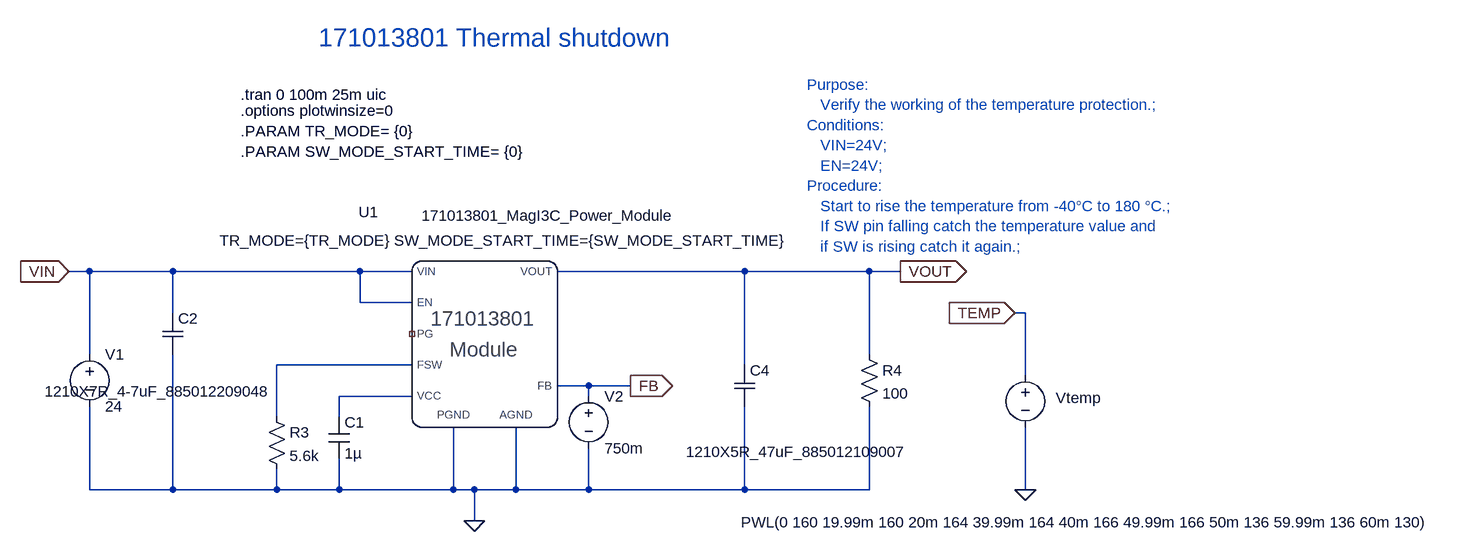
[diagram p0: schematic 171013801 thermal shutdown.asc]
171013801 thermal shutdown.asc, the LTspice schematic file:
Version 4
SHEET 1 1696 872
WIRE -384 48 -416 48
WIRE -256 48 -384 48
WIRE 32 48 -256 48
WIRE 112 48 32 48
WIRE 624 48 336 48
WIRE 816 48 624 48
WIRE 864 48 816 48
WIRE 32 96 32 48
WIRE 112 96 32 96
WIRE -256 112 -256 48
WIRE 1056 112 1040 112
WIRE -384 176 -384 48
WIRE 816 176 816 48
WIRE 112 192 -96 192
WIRE 624 192 624 48
WIRE 1056 208 1056 112
WIRE 384 224 336 224
WIRE 448 224 384 224
WIRE 112 240 0 240
WIRE 384 240 384 224
WIRE -96 272 -96 192
WIRE 0 272 0 240
WIRE -384 384 -384 256
WIRE -256 384 -256 176
WIRE -256 384 -384 384
WIRE -96 384 -96 352
WIRE -96 384 -256 384
WIRE 0 384 0 336
WIRE 0 384 -96 384
WIRE 176 384 176 288
WIRE 176 384 0 384
WIRE 208 384 176 384
WIRE 272 384 272 288
WIRE 272 384 208 384
WIRE 384 384 384 320
WIRE 384 384 272 384
WIRE 624 384 624 256
WIRE 624 384 384 384
WIRE 816 384 816 256
WIRE 816 384 624 384
WIRE 1056 384 1056 288
WIRE 208 432 208 384
FLAG 208 432 0
FLAG -416 48 VIN
IOPIN -416 48 In
FLAG 1056 384 0
FLAG 1040 112 TEMP
IOPIN 1040 112 In
FLAG 864 48 VOUT
IOPIN 864 48 Out
FLAG 448 224 FB
IOPIN 448 224 Out
SYMBOL res -112 256 R0
SYMATTR InstName R3
SYMATTR Value 5.6k
SYMBOL cap -16 272 R0
SYMATTR InstName C1
SYMATTR Value 1µ
SYMATTR SpiceLine Rser=7.13m Lser=257p
SYMBOL voltage -384 160 R0
WINDOW 123 0 0 Left 0
WINDOW 39 0 0 Left 0
SYMATTR InstName V1
SYMATTR Value 24
SYMBOL voltage 1056 192 R0
WINDOW 123 0 0 Left 0
WINDOW 39 24 124 Left 2
WINDOW 0 117 51 Right 2
WINDOW 3 636 242 Right 2
SYMATTR InstName Vtemp
SYMATTR Value PWL(0 160 19.99m 160 20m 164 39.99m 164 40m 166 49.99m 166 50m 136 59.99m 136 60m 130)
SYMBOL res 800 160 R0
SYMATTR InstName R4
SYMATTR Value 100
SYMBOL voltage 384 224 R0
WINDOW 123 0 0 Left 0
WINDOW 39 0 0 Left 0
SYMATTR InstName V2
SYMATTR Value 750m
SYMBOL WCAP-CSGP_50V_DCbias -272 112 R0
WINDOW 38 -181 121 Left 2
SYMATTR SpiceModel 1210X7R_4-7uF_885012209048
SYMATTR InstName C2
SYMBOL WCAP-CSGP_10V_DCbias 608 192 R0
WINDOW 38 -74 134 Left 2
SYMATTR SpiceModel 1210X5R_47uF_885012109007
SYMATTR InstName C4
SYMBOL 171013801_MagI3C_Power_Module 256 64 R0
SYMATTR InstName U1
TEXT -32 -312 Left 4 ;171013801 Thermal shutdown
TEXT 720 -240 Left 2 ;Purpose: \n   Verify the working of the temperature protection.; \nConditions: \n   VIN=24V; \n   EN=24V; \nProcedure: \n   Start to rise the temperature from -40°C to 180 °C.; \n   If SW pin falling catch the temperature value and \n   if SW is rising catch it again.;
TEXT -152 -224 Left 2 !.tran 0 100m 25m uic
TEXT -152 -200 Left 2 !.options plotwinsize=0
TEXT -152 -168 Left 2 !.PARAM TR_MODE= {0}\n.PARAM SW_MODE_START_TIME= {0}

The netlist it stands for:
* 171013801 thermal shutdown.asc
R3 N001 0 5.6k
C1 N002 0 1µ Rser=7.13m Lser=257p
V1 VIN 0 24
Vtemp TEMP 0 PWL(0 160 19.99m 160 20m 164 39.99m 164 40m 166 49.99m 166 50m 136 59.99m 136 60m 130)
R4 VOUT 0 100
V2 FB 0 750m
XC2 VIN 0 1210X7R_4-7uF_885012209048  ; pins A B
XC4 VOUT 0 1210X5R_47uF_885012109007  ; pins A B
XU1 VOUT FB VIN VIN NC_01 N001 N002 0 0 171013801_MagI3C_Power_Module TR_MODE={TR_MODE} SW_MODE_START_TIME={SW_MODE_START_TIME}  ; pins VOUT FB VIN EN PG FSW VCC PGND AGND
* 171013801 Thermal shutdown
* Purpose:
*    Verify the working of the temperature protection.;
* Conditions:
*    VIN=24V;
*    EN=24V;
* Procedure:
*    Start to rise the temperature from -40°C to 180 °C.;
*    If SW pin falling catch the temperature value and
*    if SW is rising catch it again.;
.tran 0 100m 25m uic
.options plotwinsize=0
.PARAM TR_MODE= {0}
.PARAM SW_MODE_START_TIME= {0}
.lib WCAP-CSGP_50V_DCbias.lib
.lib WCAP-CSGP_10V_DCbias.lib
.lib 171013801.lib
.backanno
.end